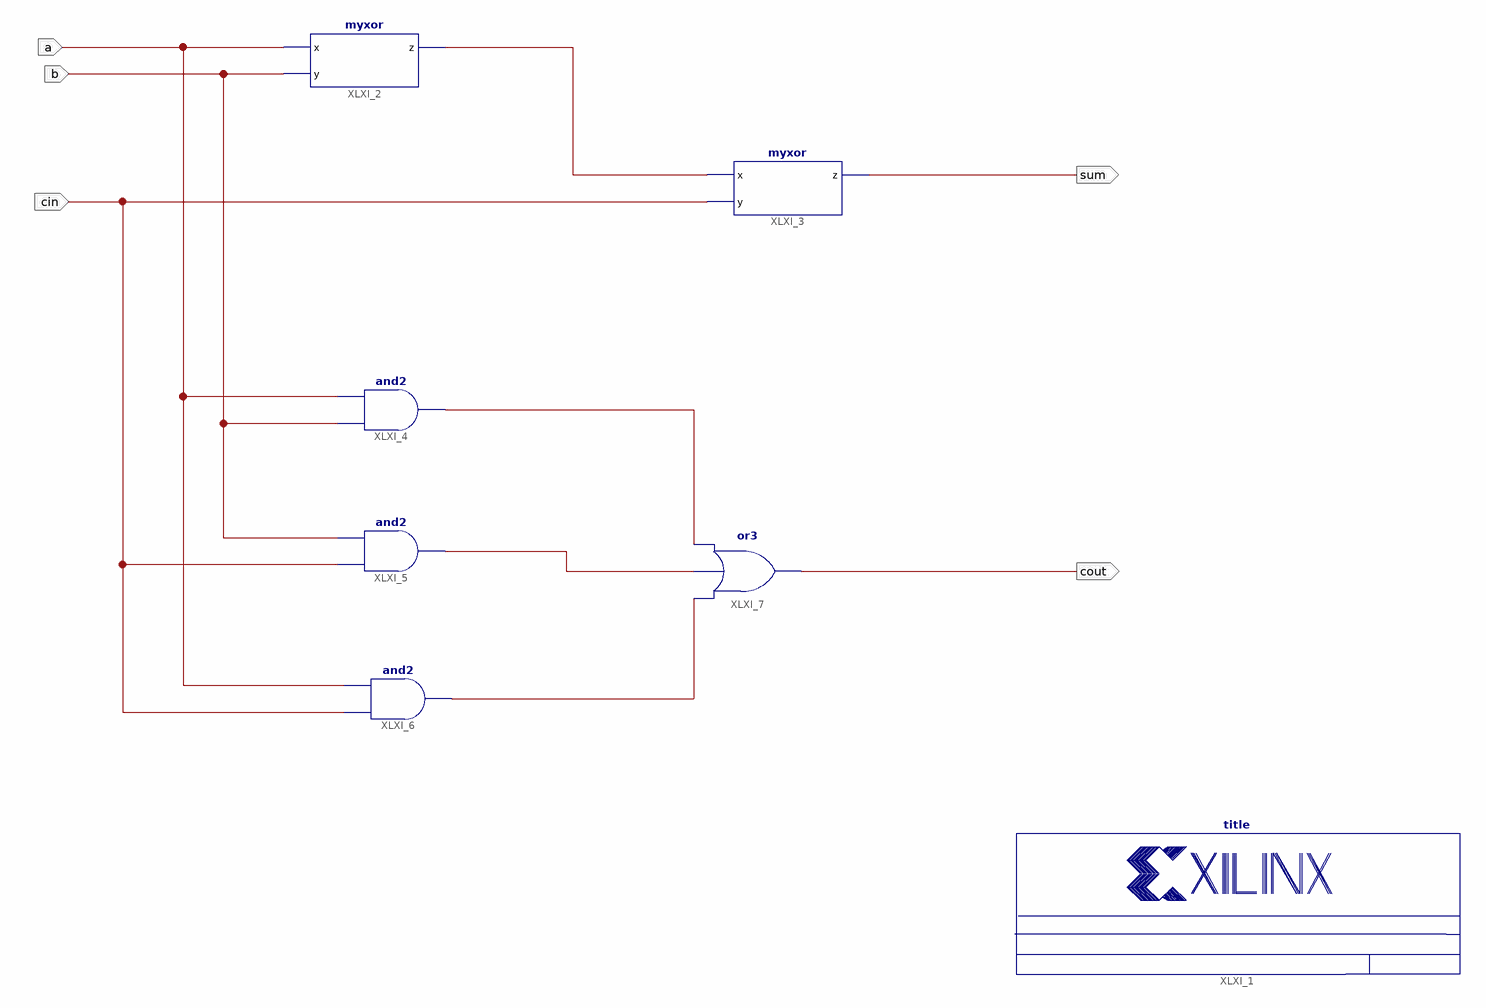
[diagram p0: schematic sheet 1]
// Xilinx ISE schematic fuller_adder_sch.sch (spartan3e) as structural Verilog: 7 symbols, 5 ports
module fuller_adder_sch (
  input  a,
  input  b,
  input  cin,
  output cout,
  output sum
);

  wire XLXN_5, XLXN_7, XLXN_8, XLXN_9;

  title #(.NameFieldText("Full adder")) XLXI_1 ();
  myxor XLXI_2 (.x(a), .y(b), .z(XLXN_5));
  myxor XLXI_3 (.x(XLXN_5), .y(cin), .z(sum));
  and XLXI_4 (XLXN_7, b, a);
  and XLXI_5 (XLXN_8, cin, b);
  and XLXI_6 (XLXN_9, cin, a);
  or XLXI_7 (cout, XLXN_9, XLXN_8, XLXN_7);
endmodule
